# EAGLE design SHIELD-LOL-SMT (EAGLE 5.04)
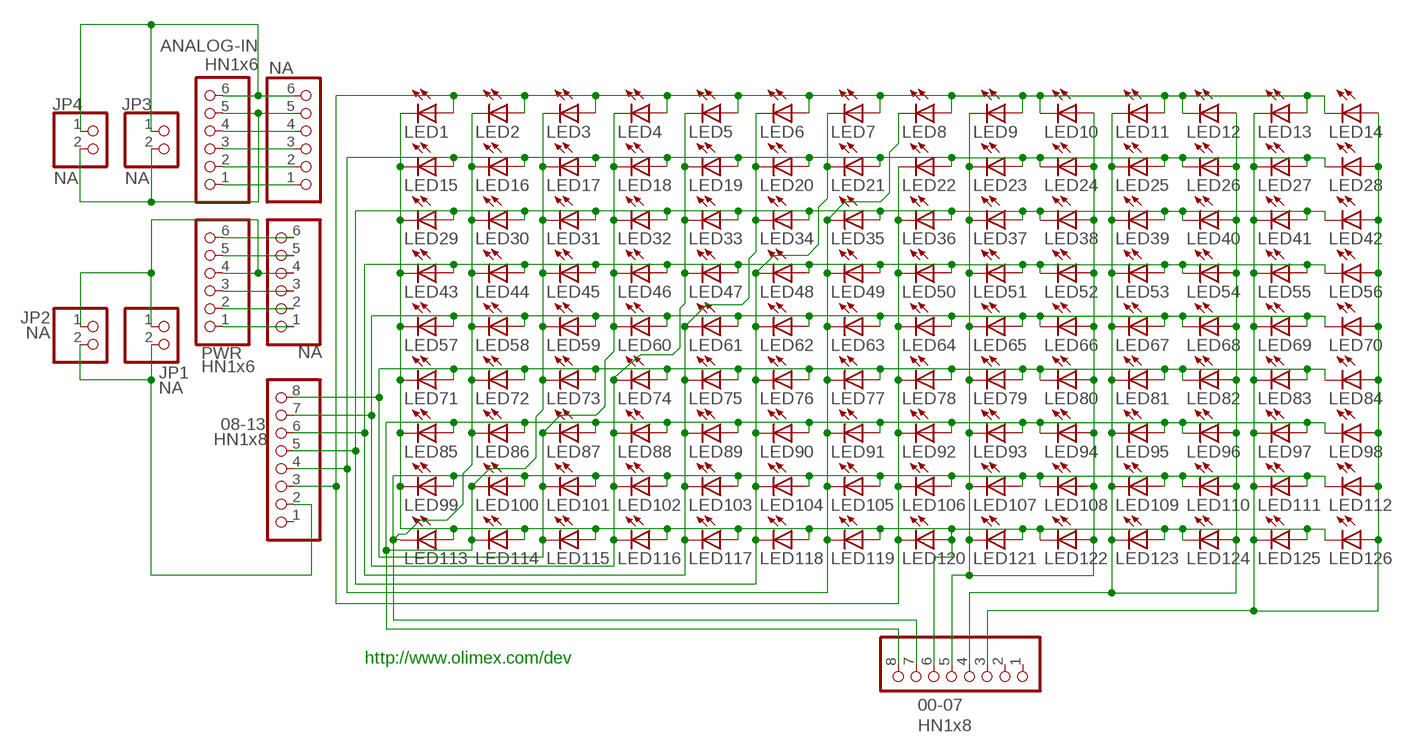
[diagram p0: schematic, sheet 1]

## Parts
00-07  HN1x8  PINHD-1X8CLEANBIG  [1X08-CLEANBIG]
08-13  HN1x8  PINHD-1X8CLEANBIG  [1X08-CLEANBIG]
AN-IN  NA  PINHD-1X6CB  [1X06-CLEANBIG]
ANALOG-IN  HN1x6  PINHD-1X6CB  [1X06-CLEANBIG]
JP1  NA  PINHD-1X2  [1X02]
JP2  NA  PINHD-1X2  [1X02]
JP3  NA  PINHD-1X2  [1X02]
JP4  NA  PINHD-1X2  [1X02]
LED1  LEDKA-3528ASYC  [KA-3528ASYC]
LED2  LEDKA-3528ASYC  [KA-3528ASYC]
LED3  LEDKA-3528ASYC  [KA-3528ASYC]
LED4  LEDKA-3528ASYC  [KA-3528ASYC]
LED5  LEDKA-3528ASYC  [KA-3528ASYC]
LED6  LEDKA-3528ASYC  [KA-3528ASYC]
LED7  LEDKA-3528ASYC  [KA-3528ASYC]
LED8  LEDKA-3528ASYC  [KA-3528ASYC]
LED9  LEDKA-3528ASYC  [KA-3528ASYC]
LED10  LEDKA-3528ASYC  [KA-3528ASYC]
LED11  LEDKA-3528ASYC  [KA-3528ASYC]
LED12  LEDKA-3528ASYC  [KA-3528ASYC]
LED13  LEDKA-3528ASYC  [KA-3528ASYC]
LED14  LEDKA-3528ASYC  [KA-3528ASYC]
LED15  LEDKA-3528ASYC  [KA-3528ASYC]
LED16  LEDKA-3528ASYC  [KA-3528ASYC]
LED17  LEDKA-3528ASYC  [KA-3528ASYC]
LED18  LEDKA-3528ASYC  [KA-3528ASYC]
LED19  LEDKA-3528ASYC  [KA-3528ASYC]
LED20  LEDKA-3528ASYC  [KA-3528ASYC]
LED21  LEDKA-3528ASYC  [KA-3528ASYC]
LED22  LEDKA-3528ASYC  [KA-3528ASYC]
LED23  LEDKA-3528ASYC  [KA-3528ASYC]
LED24  LEDKA-3528ASYC  [KA-3528ASYC]
LED25  LEDKA-3528ASYC  [KA-3528ASYC]
LED26  LEDKA-3528ASYC  [KA-3528ASYC]
LED27  LEDKA-3528ASYC  [KA-3528ASYC]
LED28  LEDKA-3528ASYC  [KA-3528ASYC]
LED29  LEDKA-3528ASYC  [KA-3528ASYC]
LED30  LEDKA-3528ASYC  [KA-3528ASYC]
LED31  LEDKA-3528ASYC  [KA-3528ASYC]
LED32  LEDKA-3528ASYC  [KA-3528ASYC]
LED33  LEDKA-3528ASYC  [KA-3528ASYC]
LED34  LEDKA-3528ASYC  [KA-3528ASYC]
LED35  LEDKA-3528ASYC  [KA-3528ASYC]
LED36  LEDKA-3528ASYC  [KA-3528ASYC]
LED37  LEDKA-3528ASYC  [KA-3528ASYC]
LED38  LEDKA-3528ASYC  [KA-3528ASYC]
LED39  LEDKA-3528ASYC  [KA-3528ASYC]
LED40  LEDKA-3528ASYC  [KA-3528ASYC]
LED41  LEDKA-3528ASYC  [KA-3528ASYC]
LED42  LEDKA-3528ASYC  [KA-3528ASYC]
LED43  LEDKA-3528ASYC  [KA-3528ASYC]
LED44  LEDKA-3528ASYC  [KA-3528ASYC]
LED45  LEDKA-3528ASYC  [KA-3528ASYC]
LED46  LEDKA-3528ASYC  [KA-3528ASYC]
LED47  LEDKA-3528ASYC  [KA-3528ASYC]
LED48  LEDKA-3528ASYC  [KA-3528ASYC]
LED49  LEDKA-3528ASYC  [KA-3528ASYC]
LED50  LEDKA-3528ASYC  [KA-3528ASYC]
LED51  LEDKA-3528ASYC  [KA-3528ASYC]
LED52  LEDKA-3528ASYC  [KA-3528ASYC]
LED53  LEDKA-3528ASYC  [KA-3528ASYC]
LED54  LEDKA-3528ASYC  [KA-3528ASYC]
LED55  LEDKA-3528ASYC  [KA-3528ASYC]
LED56  LEDKA-3528ASYC  [KA-3528ASYC]
LED57  LEDKA-3528ASYC  [KA-3528ASYC]
LED58  LEDKA-3528ASYC  [KA-3528ASYC]
LED59  LEDKA-3528ASYC  [KA-3528ASYC]
LED60  LEDKA-3528ASYC  [KA-3528ASYC]
LED61  LEDKA-3528ASYC  [KA-3528ASYC]
LED62  LEDKA-3528ASYC  [KA-3528ASYC]
LED63  LEDKA-3528ASYC  [KA-3528ASYC]
LED64  LEDKA-3528ASYC  [KA-3528ASYC]
LED65  LEDKA-3528ASYC  [KA-3528ASYC]
LED66  LEDKA-3528ASYC  [KA-3528ASYC]
LED67  LEDKA-3528ASYC  [KA-3528ASYC]
LED68  LEDKA-3528ASYC  [KA-3528ASYC]
LED69  LEDKA-3528ASYC  [KA-3528ASYC]
LED70  LEDKA-3528ASYC  [KA-3528ASYC]
LED71  LEDKA-3528ASYC  [KA-3528ASYC]
LED72  LEDKA-3528ASYC  [KA-3528ASYC]
LED73  LEDKA-3528ASYC  [KA-3528ASYC]
LED74  LEDKA-3528ASYC  [KA-3528ASYC]
LED75  LEDKA-3528ASYC  [KA-3528ASYC]
LED76  LEDKA-3528ASYC  [KA-3528ASYC]
LED77  LEDKA-3528ASYC  [KA-3528ASYC]
LED78  LEDKA-3528ASYC  [KA-3528ASYC]
LED79  LEDKA-3528ASYC  [KA-3528ASYC]
LED80  LEDKA-3528ASYC  [KA-3528ASYC]
LED81  LEDKA-3528ASYC  [KA-3528ASYC]
LED82  LEDKA-3528ASYC  [KA-3528ASYC]
LED83  LEDKA-3528ASYC  [KA-3528ASYC]
LED84  LEDKA-3528ASYC  [KA-3528ASYC]
LED85  LEDKA-3528ASYC  [KA-3528ASYC]
LED86  LEDKA-3528ASYC  [KA-3528ASYC]
LED87  LEDKA-3528ASYC  [KA-3528ASYC]
LED88  LEDKA-3528ASYC  [KA-3528ASYC]
LED89  LEDKA-3528ASYC  [KA-3528ASYC]
LED90  LEDKA-3528ASYC  [KA-3528ASYC]
LED91  LEDKA-3528ASYC  [KA-3528ASYC]
LED92  LEDKA-3528ASYC  [KA-3528ASYC]
LED93  LEDKA-3528ASYC  [KA-3528ASYC]
LED94  LEDKA-3528ASYC  [KA-3528ASYC]
LED95  LEDKA-3528ASYC  [KA-3528ASYC]
LED96  LEDKA-3528ASYC  [KA-3528ASYC]
LED97  LEDKA-3528ASYC  [KA-3528ASYC]
LED98  LEDKA-3528ASYC  [KA-3528ASYC]
LED99  LEDKA-3528ASYC  [KA-3528ASYC]
LED100  LEDKA-3528ASYC  [KA-3528ASYC]
LED101  LEDKA-3528ASYC  [KA-3528ASYC]
LED102  LEDKA-3528ASYC  [KA-3528ASYC]
LED103  LEDKA-3528ASYC  [KA-3528ASYC]
LED104  LEDKA-3528ASYC  [KA-3528ASYC]
LED105  LEDKA-3528ASYC  [KA-3528ASYC]
LED106  LEDKA-3528ASYC  [KA-3528ASYC]
LED107  LEDKA-3528ASYC  [KA-3528ASYC]
LED108  LEDKA-3528ASYC  [KA-3528ASYC]
LED109  LEDKA-3528ASYC  [KA-3528ASYC]
LED110  LEDKA-3528ASYC  [KA-3528ASYC]
LED111  LEDKA-3528ASYC  [KA-3528ASYC]
LED112  LEDKA-3528ASYC  [KA-3528ASYC]
LED113  LEDKA-3528ASYC  [KA-3528ASYC]
LED114  LEDKA-3528ASYC  [KA-3528ASYC]
LED115  LEDKA-3528ASYC  [KA-3528ASYC]
LED116  LEDKA-3528ASYC  [KA-3528ASYC]
LED117  LEDKA-3528ASYC  [KA-3528ASYC]
LED118  LEDKA-3528ASYC  [KA-3528ASYC]
LED119  LEDKA-3528ASYC  [KA-3528ASYC]
LED120  LEDKA-3528ASYC  [KA-3528ASYC]
LED121  LEDKA-3528ASYC  [KA-3528ASYC]
LED122  LEDKA-3528ASYC  [KA-3528ASYC]
LED123  LEDKA-3528ASYC  [KA-3528ASYC]
LED124  LEDKA-3528ASYC  [KA-3528ASYC]
LED125  LEDKA-3528ASYC  [KA-3528ASYC]
LED126  LEDKA-3528ASYC  [KA-3528ASYC]
POWER  NA  PINHD-1X6CB  [1X06-CLEANBIG]
PWR  HN1x6  PINHD-1X6CB  [1X06-CLEANBIG]

## Nets
N$1: 08-13.2 JP1.2 JP2.2
N$2: AN-IN.5 ANALOG-IN.5 JP3.2 JP4.2
N$5: 00-07.5 LED9.C LED10.A LED23.C LED24.A LED37.C LED38.A LED51.C LED52.A LED65.C LED66.A LED79.C LED80.A LED93.C LED94.A LED107.C LED108.A LED121.C LED122.A
N$11: AN-IN.6 ANALOG-IN.6 JP3.1 JP4.1
N$12: JP1.1 JP2.1 POWER.4 PWR.4
N$39: AN-IN.4 ANALOG-IN.4
N$40: AN-IN.3 ANALOG-IN.3
N$41: AN-IN.2 ANALOG-IN.2
N$42: AN-IN.1 ANALOG-IN.1
N$43: POWER.6 PWR.6
N$44: POWER.5 PWR.5
N$46: POWER.3 PWR.3
N$47: POWER.2 PWR.2
N$48: POWER.1 PWR.1
PIN2: 00-07.3 LED13.C LED14.A LED27.C LED28.A LED41.C LED42.A LED55.C LED56.A LED69.C LED70.A LED83.C LED84.A LED97.C LED98.A LED111.C LED112.A LED125.C LED126.A
PIN3: 00-07.4 LED11.C LED12.A LED25.C LED26.A LED39.C LED40.A LED53.C LED54.A LED67.C LED68.A LED81.C LED82.A LED95.C LED96.A LED109.C LED110.A LED123.C LED124.A
PIN5: 00-07.6 LED1.C LED15.C LED29.C LED43.C LED57.C LED71.C LED85.C LED99.C LED113.A LED114.A LED115.A LED116.A LED117.A LED118.A LED119.A LED120.A LED121.A LED122.C LED123.A LED124.C LED125.A LED126.C
PIN6: 00-07.7 LED2.C LED16.C LED30.C LED44.C LED58.C LED72.C LED86.C LED99.A LED100.A LED101.A LED102.A LED103.A LED104.A LED105.A LED106.A LED107.A LED108.C LED109.A LED110.C LED111.A LED112.C LED113.C
PIN7: 00-07.8 LED3.C LED17.C LED31.C LED45.C LED59.C LED73.C LED85.A LED86.A LED87.A LED88.A LED89.A LED90.A LED91.A LED92.A LED93.A LED94.C LED95.A LED96.C LED97.A LED98.C LED100.C LED114.C
PIN8: 08-13.8 LED4.C LED18.C LED32.C LED46.C LED60.C LED71.A LED72.A LED73.A LED74.A LED75.A LED76.A LED77.A LED78.A LED79.A LED80.C LED81.A LED82.C LED83.A LED84.C LED87.C LED101.C LED115.C
PIN9: 08-13.7 LED5.C LED19.C LED33.C LED47.C LED57.A LED58.A LED59.A LED60.A LED61.A LED62.A LED63.A LED64.A LED65.A LED66.C LED67.A LED68.C LED69.A LED70.C LED74.C LED88.C LED102.C LED116.C
PIN10: 08-13.6 LED6.C LED20.C LED34.C LED43.A LED44.A LED45.A LED46.A LED47.A LED48.A LED49.A LED50.A LED51.A LED52.C LED53.A LED54.C LED55.A LED56.C LED61.C LED75.C LED89.C LED103.C LED117.C
PIN11: 08-13.5 LED7.C LED21.C LED29.A LED30.A LED31.A LED32.A LED33.A LED34.A LED35.A LED36.A LED37.A LED38.C LED39.A LED40.C LED41.A LED42.C LED48.C LED62.C LED76.C LED90.C LED104.C LED118.C
PIN12: 08-13.4 LED8.C LED15.A LED16.A LED17.A LED18.A LED19.A LED20.A LED21.A LED22.A LED23.A LED24.C LED25.A LED26.C LED27.A LED28.C LED35.C LED49.C LED63.C LED77.C LED91.C LED105.C LED119.C
PIN13: 08-13.3 LED1.A LED2.A LED3.A LED4.A LED5.A LED6.A LED7.A LED8.A LED9.A LED10.C LED11.A LED12.C LED13.A LED14.C LED22.C LED36.C LED50.C LED64.C LED78.C LED92.C LED106.C LED120.C
Unconnected: 00-07.1 00-07.2 08-13.1

## Notes on the sheet
- http://www.olimex.com/dev

## Library data of the parts
00-07 08-13 = carduino:PINHD-1X8: PIN HEADER
AN-IN ANALOG-IN POWER PWR = carduino:PINHD-1X6: PIN HEADER
JP1 JP2 JP4 = pinhead:PINHD-1X2: PIN HEADER
JP3 = custom-jpr:PINHD-1X2: PIN HEADER
LED1-LED126 = led:LED: LED OSRAM: - CHIPLED LG R971, LG N971, LY N971, LG Q971, LY Q971, LO R971, LY R971 LH N974, LH R974 LS Q976, LO Q976, LY Q976 LO Q996 - Hyper CHIPLED LW Q18S LB Q993, LB Q99A, LB R99A - SideLED LS A670, LO A670, LY A670, LG A670, LP A670 LB A673, LV A673, LT A673, LW A673 LH A674 LY A675 LS A676, LA A676, LO A676, LY A676, LW A676 LS A679, LY A679, LG A679 - Hyper Micro SIDELED® LS Y876, LA Y876, LO Y876, LY Y876 LT Y87S - SmartLED LW L88C, LW L88S LB L89C, LB L89S, LG L890 LS L89K, LO L89K, LY L89K LS L896, LA L896, LO L896, LY L896 - TOPLED LS T670, LO T670, LY T670, LG T670, LP T670 LSG T670, LSP T670, LSY T670, LOP T670, LYG T670 LG T671, LOG T671, LSG T671 LB T673, LV T673, LT T673, LW T673 LH T674 LS T676, LA T676, LO T676, LY T676, LB T676, LH T676, LSB T676, LW T676 LB T67C, LV T67C, LT T67C, LS T67K, LO T67K, LY T67K, LW E67C LS E67B, LA E67B, LO E67B, LY E67B, LB E67C, LV E67C, LT E67C LW T67C LS T679, LY T679, LG T679 LS T770, LO T770, LY T770, LG T770, LP T770 LB T773, LV T773, LT T773, LW T773 LH T774 LS E675, LA E675, LY E675, LS T675 LS T776, LA T776, LO T776, LY T776, LB T776 LHGB T686 LT T68C, LB T68C - Hyper Mini TOPLED® LB M676 - Mini TOPLED Santana® LG M470 LS M47K, LO M47K, LY M47K Source: http://www.osram.convergy.de LUXEON: - LUMILED® LXK2-PW12-R00, LXK2-PW12-S00, LXK2-PW14-U00, LXK2-PW14-V00 LXK2-PM12-R00, LXK2-PM12-S00, LXK2-PM14-U00 LXK2-PE12-Q00, LXK2-PE12-R00, LXK2-PE12-S00, LXK2-PE14-T00, LXK2-PE14-U00 LXK2-PB12-K00, LXK2-PB12-L00, LXK2-PB12-M00, LXK2-PB14-N00, LXK2-PB14-P00, LXK2-PB14-Q00 LXK2-PR12-L00, LXK2-PR12-M00, LXK2-PR14-Q00, LXK2-PR14-R00 LXK2-PD12-Q00, LXK2-PD12-R00, LXK2-PD12-S00 LXK2-PH12-R00, LXK2-PH12-S00 LXK2-PL12-P00, LXK2-PL12-Q00, LXK2-PL12-R00 Source: www.luxeon.com KINGBRIGHT: KA-3528ASYC Source: www.kingbright.com

## Board
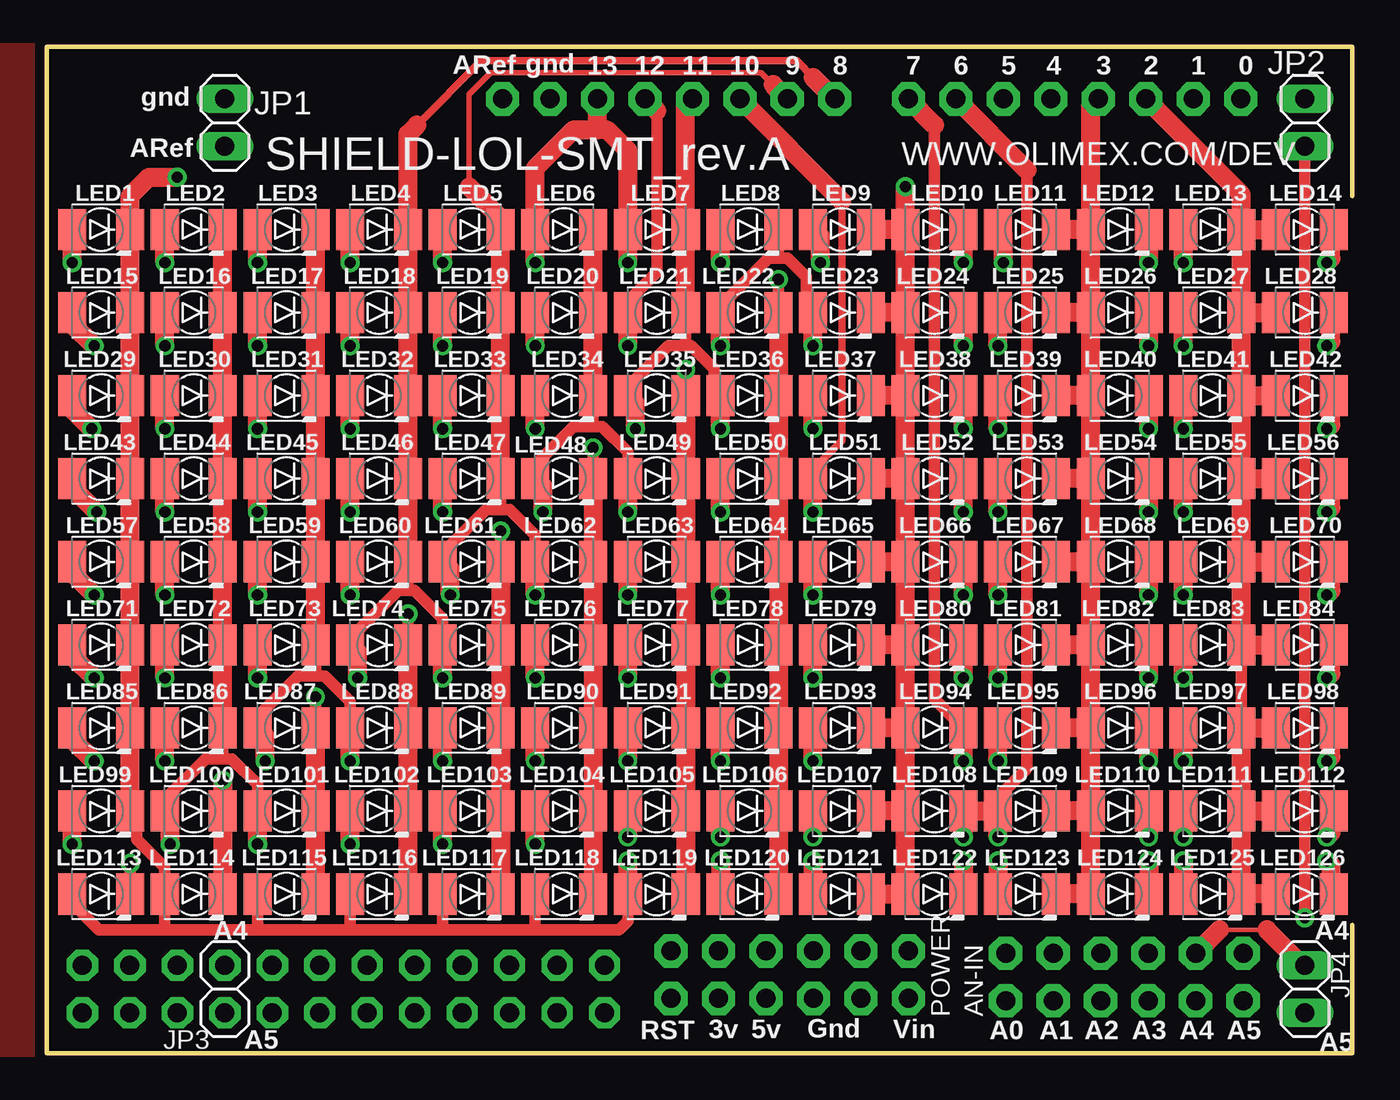
[diagram p1: board, top side]
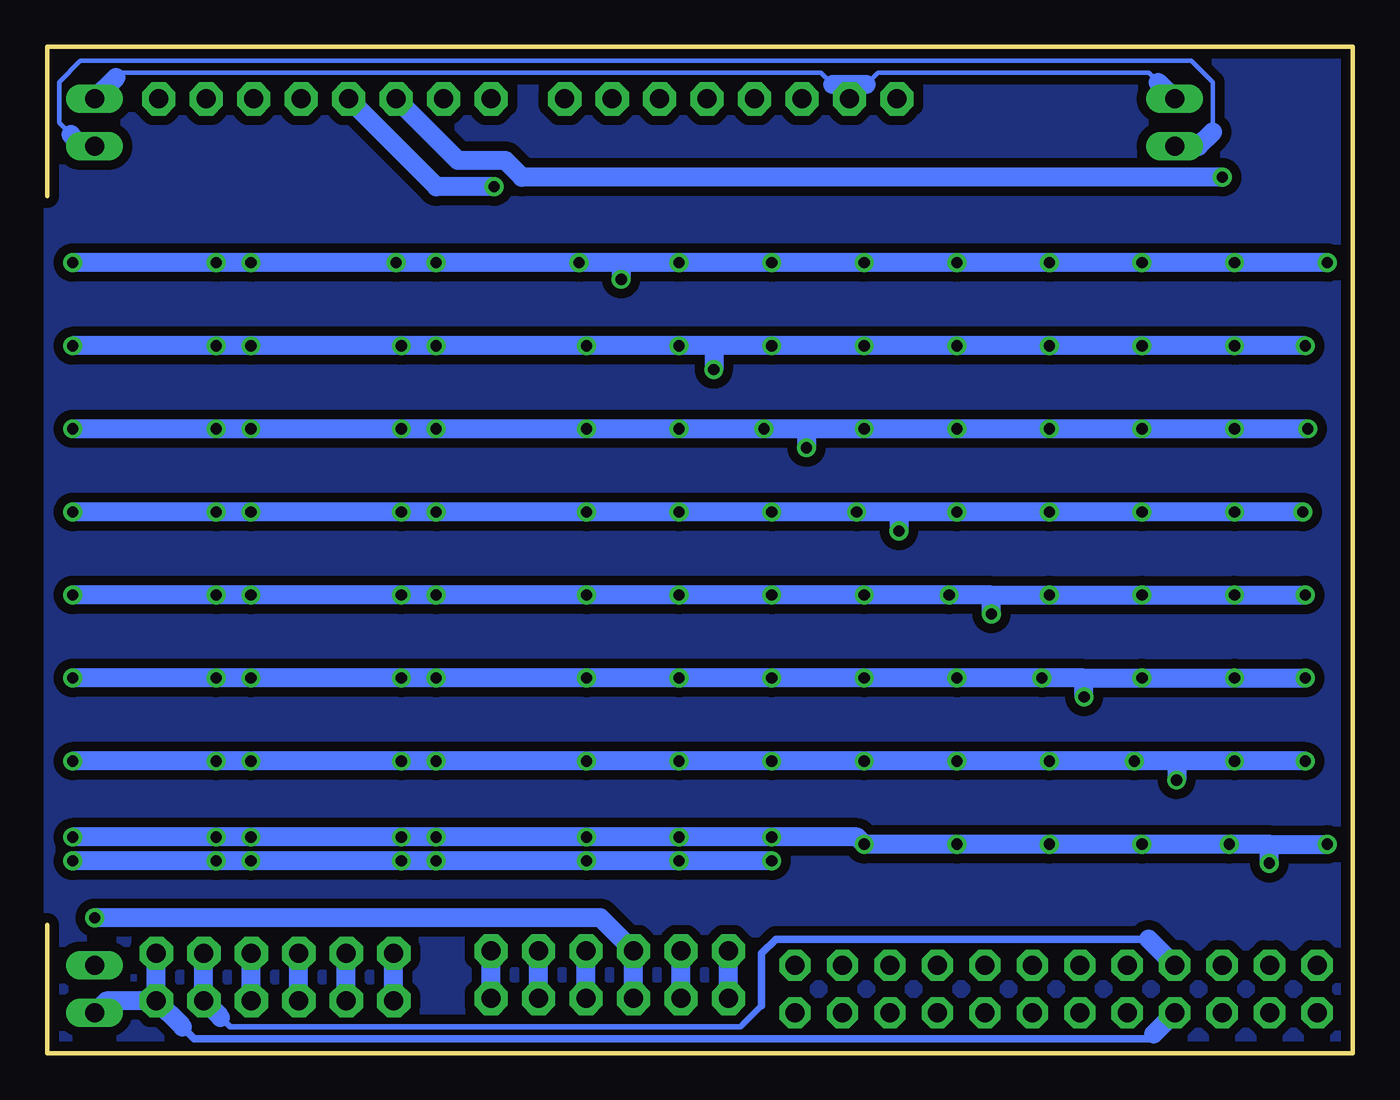
[diagram p2: board, bottom side, seen from below]

Size 69.85 x 53.85 mm. Coordinates in mm from the lower left corner, seen from the top.
Outline: 69.85,45.85 69.85,53.85 0,53.85 0,0 69.85,0 69.85,6.86
Copper layers (1+16): Top 0.035mm / dielectric 1.5mm / Bottom 0.035mm
Design rules "default *": minimum track width 10mil, minimum drill 19mil, track to track 10mil, track to pad 10mil, pad to pad 10mil, via to via 10mil, smd to smd 0mil, copper to edge 10mil, drill to drill 8mil, minimum pad ring 10mil, minimum via ring 8mil, stop-mask expansion 4mil, vias tented up to drill 32mil, thermal gap 10mil

### Footprints (pad centres in the part's own frame; a part is rotated, then mirrored left to right if it is on the bottom)
1X08-CLEANBIG = drill 1.016 pad 1.778 octagon: 1 -8.89,0; 2 -6.35,0; 3 -3.81,0; 4 -1.27,0; 5 1.27,0; 6 3.81,0; 7 6.35,0; 8 8.89,0
1X06-CLEANBIG = drill 1.016 pad 1.778 octagon: 1 -6.35,0; 2 -3.81,0; 3 -1.27,0; 4 1.27,0; 5 3.81,0; 6 6.35,0
1X02 = drill 1.016 long: 1 -1.27,0; 2 1.27,0
1X02' = drill 1.016 pad 1.676 octagon: 1 -1.27,0; 2 1.27,0
KA-3528ASYC = smd 1.5 x 2.2: A -1.55,0; C 1.55,0

### Placement (x,y rotation side)
00-07  54.99,51.05 180 top
08-13  33.27,51.05 0 top
AN-IN  57.66,5.33 0 top
ANALOG-IN  57.66,2.79 0 top
JP1  9.53,49.78 90 top
JP2  67.31,49.78 90 top
JP3  NA  [1X02']  9.53,3.43 90 top
JP4  67.31,3.43 90 top
LED1  2.92,44.07 0 top
LED2  7.87,44.07 0 top
LED3  12.83,44.07 0 top
LED4  17.78,44.07 0 top
LED5  22.73,44.07 0 top
LED6  27.69,44.07 0 top
LED7  32.64,44.07 0 top
LED8  37.59,44.07 0 top
LED9  42.55,44.07 0 top
LED10  47.5,44.07 0 top
LED11  52.45,44.07 0 top
LED12  57.4,44.07 0 top
LED13  62.36,44.07 0 top
LED14  67.31,44.07 0 top
LED15  2.92,39.62 0 top
LED16  7.87,39.62 0 top
LED17  12.83,39.62 0 top
LED18  17.78,39.62 0 top
LED19  22.73,39.62 0 top
LED20  27.69,39.62 0 top
LED21  32.64,39.62 0 top
LED22  37.59,39.62 0 top
LED23  42.55,39.62 0 top
LED24  47.5,39.62 0 top
LED25  52.45,39.62 0 top
LED26  57.4,39.62 0 top
LED27  62.36,39.62 0 top
LED28  67.31,39.62 0 top
LED29  2.92,35.18 0 top
LED30  7.87,35.18 0 top
LED31  12.83,35.18 0 top
LED32  17.78,35.18 0 top
LED33  22.73,35.18 0 top
LED34  27.69,35.18 0 top
LED35  32.64,35.18 0 top
LED36  37.59,35.18 0 top
LED37  42.55,35.18 0 top
LED38  47.5,35.18 0 top
LED39  52.45,35.18 0 top
LED40  57.4,35.18 0 top
LED41  62.36,35.18 0 top
LED42  67.31,35.18 0 top
LED43  2.92,30.73 0 top
LED44  7.87,30.73 0 top
LED45  12.83,30.73 0 top
LED46  17.78,30.73 0 top
LED47  22.73,30.73 0 top
LED48  27.69,30.73 0 top
LED49  32.64,30.73 0 top
LED50  37.59,30.73 0 top
LED51  42.55,30.73 0 top
LED52  47.5,30.73 0 top
LED53  52.45,30.73 0 top
LED54  57.4,30.73 0 top
LED55  62.36,30.73 0 top
LED56  67.31,30.73 0 top
LED57  2.92,26.29 0 top
LED58  7.87,26.29 0 top
LED59  12.83,26.29 0 top
LED60  17.78,26.29 0 top
LED61  22.73,26.29 0 top
LED62  27.69,26.29 0 top
LED63  32.64,26.29 0 top
LED64  37.59,26.29 0 top
LED65  42.55,26.29 0 top
LED66  47.5,26.29 0 top
LED67  52.45,26.29 0 top
LED68  57.4,26.29 0 top
LED69  62.36,26.29 0 top
LED70  67.31,26.29 0 top
LED71  2.92,21.84 0 top
LED72  7.87,21.84 0 top
LED73  12.83,21.84 0 top
LED74  17.78,21.84 0 top
LED75  22.73,21.84 0 top
LED76  27.69,21.84 0 top
LED77  32.64,21.84 0 top
LED78  37.59,21.84 0 top
LED79  42.55,21.84 0 top
LED80  47.5,21.84 0 top
LED81  52.45,21.84 0 top
LED82  57.4,21.84 0 top
LED83  62.36,21.84 0 top
LED84  67.31,21.84 0 top
LED85  2.92,17.4 0 top
LED86  7.87,17.4 0 top
LED87  12.83,17.4 0 top
LED88  17.78,17.4 0 top
LED89  22.73,17.4 0 top
LED90  27.69,17.4 0 top
LED91  32.64,17.4 0 top
LED92  37.59,17.4 0 top
LED93  42.55,17.4 0 top
LED94  47.5,17.4 0 top
LED95  52.45,17.4 0 top
LED96  57.4,17.4 0 top
LED97  62.36,17.4 0 top
LED98  67.31,17.4 0 top
LED99  2.92,12.95 0 top
LED100  7.87,12.95 0 top
LED101  12.83,12.95 0 top
LED102  17.78,12.95 0 top
LED103  22.73,12.95 0 top
LED104  27.69,12.95 0 top
LED105  32.64,12.95 0 top
LED106  37.59,12.95 0 top
LED107  42.55,12.95 0 top
LED108  47.5,12.95 0 top
LED109  52.45,12.95 0 top
LED110  57.4,12.95 0 top
LED111  62.36,12.95 0 top
LED112  67.31,12.95 0 top
LED113  2.92,8.51 0 top
LED114  7.87,8.51 0 top
LED115  12.83,8.51 0 top
LED116  17.78,8.51 0 top
LED117  22.73,8.51 0 top
LED118  27.69,8.51 0 top
LED119  32.64,8.51 0 top
LED120  37.59,8.51 0 top
LED121  42.55,8.51 0 top
LED122  47.5,8.51 0 top
LED123  52.45,8.51 0 top
LED124  57.4,8.51 0 top
LED125  62.36,8.51 0 top
LED126  67.31,8.51 0 top
POWER  39.75,5.46 180 top
PWR  39.75,2.92 180 top

### Tracks (layer width: path | path; a pad name or v marks a point on that pad's centre or on a via)
BOTTOMFILL
  pour Bottom (isolate 0.508): 0,53.85 69.85,53.85 69.85,0 0,0
N$1
  Bottom 0.254: 10.41,51.94 10.92,52.45 25.4,52.45 26.04,51.82 | 27.81,51.82 28.45,52.45 65.91,52.45 66.17,52.2
  Bottom 1.016: JP1.2 10.41,51.94 | 26.04,51.82 26.92,51.82 | 26.92,51.82 08-13.2 | 26.92,51.82 27.81,51.82 | 66.17,52.2 JP2.2
N$2
  Top 0.254: 62.74,6.6 65.28,6.6
  Top 1.016: AN-IN.5 62.74,6.6 | 65.28,6.6 67.18,4.7 JP4.2
  Bottom 0.305: 60.58,1.91 60.07,1.4 32.77,1.4 31.62,2.54
  Bottom 0.406: 10.92,6.1 30.86,6.1 31.62,5.33 31.62,2.54
  Bottom 1.016: AN-IN.5 ANALOG-IN.5 60.58,1.91 | JP3.2 10.92,6.1
N$3  (via drill 1.02 pad 1.68)
  other vias: 6.99,4.7
N$5  (via drill 0.6)
  Top 1.016: LED121.C LED122.A LED108.A | LED108.A LED107.C | LED94.A LED93.C | LED80.A LED79.C | LED66.A LED65.C | LED52.A LED51.C | LED38.A LED37.C | LED24.A LED23.C | LED10.A LED9.C | LED24.A LED10.A | LED38.A LED24.A | LED52.A LED38.A | LED94.A LED80.A | LED80.A LED66.A | LED66.A LED52.A | LED108.A LED94.A | LED10.A v45.95,46.35
  Bottom 1.016: v45.95,46.35 49.02,46.35 00-07.5
N$7  (via drill 1.02 pad 1.68)
  other vias: 12.06,4.7
N$8  (via drill 1.02 pad 1.68)
  other vias: 14.61,4.7
N$9  (via drill 1.02 pad 1.68)
  other vias: 17.14,4.7
N$10  (via drill 1.02 pad 1.68)
  other vias: 19.68,4.7
N$11
  Bottom 0.406: 10.67,1.02 10.92,0.76 61.98,0.76 62.61,1.4
  Bottom 1.016: ANALOG-IN.6 AN-IN.6 | ANALOG-IN.6 66.67,2.79 JP4.1 | JP3.1 10.67,1.02 | 62.61,1.4 ANALOG-IN.6
N$12  (via drill 0.6)
  Top 0.61: v67.31,7.24 JP2.1
  Bottom 0.254: 7.49,49.28 7.49,51.94 8.64,53.09 68.07,53.09 69.22,51.94 69.22,49.78 68.58,49.15
  Bottom 1.016: PWR.4 POWER.4 40.26,7.24 v67.31,7.24 | JP1.1 8.26,48.51 7.49,49.28 | 68.58,49.15 67.94,48.51 JP2.1
N$13  (via drill 1.02 pad 1.68)
  other vias: 6.99,2.16
N$15  (via drill 1.02 pad 1.68)
  other vias: 12.06,2.16
N$18  (via drill 1.02 pad 1.68)
  other vias: 14.61,2.16
N$27  (via drill 1.02 pad 1.68)
  other vias: 17.14,2.16
N$28  (via drill 1.02 pad 1.68)
  other vias: 19.68,2.16
N$29  (via drill 1.02 pad 1.68)
  other vias: 22.23,4.7
N$30  (via drill 1.02 pad 1.68)
  other vias: 22.23,2.16
N$31  (via drill 1.02 pad 1.68)
  other vias: 24.77,4.7
N$32  (via drill 1.02 pad 1.68)
  other vias: 24.77,2.16
N$33  (via drill 1.02 pad 1.68)
  other vias: 29.84,4.7
N$34  (via drill 1.02 pad 1.68)
  other vias: 27.3,2.16
N$35  (via drill 1.02 pad 1.68)
  other vias: 29.84,2.16
N$36  (via drill 1.02 pad 1.68)
  other vias: 27.3,4.7
N$37  (via drill 1.02 pad 1.68)
  other vias: 1.91,4.7
N$38  (via drill 1.02 pad 1.68)
  other vias: 1.91,2.16
N$39
  Bottom 1.016: ANALOG-IN.4 AN-IN.4
N$40
  Bottom 1.016: ANALOG-IN.3 AN-IN.3
N$41
  Bottom 1.016: ANALOG-IN.2 AN-IN.2
N$42
  Bottom 1.016: ANALOG-IN.1 AN-IN.1
N$43
  Bottom 1.016: PWR.6 POWER.6
N$44
  Bottom 1.016: PWR.5 POWER.5
N$45  (via drill 1.02 pad 1.68)
  other vias: 4.45,4.7
N$46
  Bottom 1.016: PWR.3 POWER.3
N$47
  Bottom 1.016: PWR.2 POWER.2
N$48
  Bottom 1.016: PWR.1 POWER.1
N$49  (via drill 1.02 pad 1.68)
  other vias: 4.45,2.16
PIN2
  Top 0.61: LED97.C LED83.C
  Top 1.016: LED111.C LED112.A | LED98.A LED97.C LED111.C | LED84.A LED83.C LED69.C | LED69.C LED70.A | LED55.C LED56.A | LED41.C LED42.A | LED27.C LED28.A | LED126.A LED125.C LED111.C | LED69.C LED55.C | LED55.C LED41.C | LED41.C LED27.C | LED13.C 63.91,45.95 00-07.3 | LED13.C LED14.A | LED27.C LED13.C
PIN3
  Top 1.016: LED12.A LED11.C | LED26.A LED25.C | LED40.A LED39.C | LED54.A LED53.C | LED68.A LED67.C | LED82.A LED81.C | LED96.A LED95.C | LED110.A LED109.C | LED123.C LED124.A LED110.A | LED110.A LED96.A | LED96.A LED82.A | LED82.A LED68.A | LED68.A LED54.A | LED54.A LED40.A | LED40.A LED26.A | LED26.A LED12.A | LED12.A 55.85,50.65 00-07.4
PIN5  (via drill 0.6)
  Top 0.61: LED99.C 4.83,12.6 4.83,11.43 6.32,9.93 LED114.A 6.32,6.6 | LED113.A 1.37,8.03 2.79,6.6 6.32,6.6 | 11.28,6.6 LED115.A | 16.23,6.6 LED116.A | 21.18,6.6 LED117.A | 26.14,6.6 LED118.A | 6.32,6.6 11.28,6.6 | 11.28,6.6 16.23,6.6 | 16.23,6.6 21.18,6.6 | 21.18,6.6 26.14,6.6 | LED119.A 31.09,7.09 30.61,6.6 26.14,6.6
  Top 1.016: LED99.C LED85.C LED71.C LED57.C LED43.C LED29.C LED15.C LED1.C 4.47,45.87 5.46,46.86 v6.99,46.86 | v68.48,10.29 68.71,10.06 68.71,8.66 LED126.C | v40.99,10.29 LED121.A | v49.05,10.29 LED122.C | v58.95,10.29 LED124.C | LED119.A v31.09,10.29 | v36.04,10.29 LED120.A | v50.9,10.29 LED123.A | v60.81,10.29 LED125.A
  Bottom 1.016: v68.48,10.29 v60.81,10.29 v58.95,10.29 v50.9,10.29 v49.05,10.29 v40.99,10.29 v36.04,10.29 v31.09,10.29 | v6.99,46.86 44.45,46.86 45.34,47.75 47.88,47.75 00-07.6
PIN6  (via drill 0.6)
  Top 0.61: 9.42,15.75 LED86.C | LED101.A 11.28,14.38 9.91,15.75 9.42,15.75 | 9.42,15.75 8.51,15.75 6.32,13.56 | LED113.C v4.47,10.16 | 52.45,47.24 52.45,15.24 50.9,13.69 LED109.A
  Top 1.016: LED86.C LED72.C LED58.C LED44.C LED30.C LED16.C LED2.C | 6.32,13.56 LED100.A | v68.48,11.56 68.71,11.79 68.71,12.8 LED112.C | v1.37,11.18 LED99.A | v6.6,11.18 6.6,12.83 | v50.9,11.56 LED109.A LED108.C v49.05,11.56 | v40.99,11.56 LED107.A | v36.04,11.56 LED106.A | v31.09,11.56 LED105.A | v26.14,11.18 LED104.A | v21.18,11.18 LED103.A | v16.23,11.18 LED102.A | v11.28,11.18 LED101.A | v58.95,11.56 LED110.C | v60.81,11.56 LED111.A | 52.45,47.24 00-07.7
  Bottom 1.016: 4.47,11.18 v1.37,11.18 | v4.47,10.16 4.47,11.18 | 4.47,11.18 v6.6,11.18 v11.28,11.18 v16.23,11.18 v21.18,11.18 v26.14,11.18 26.52,11.56 v31.09,11.56 v36.04,11.56 v40.99,11.56 v49.05,11.56 v50.9,11.56 v58.95,11.56 v60.81,11.56 v68.48,11.56
PIN7  (via drill 0.6)
  Top 0.61: LED88.A 16.23,18.82 14.86,20.19 14.38,20.19 | 14.38,20.19 LED73.C | LED87.A 11.28,18.01 13.46,20.19 14.38,20.19 | LED94.C 47.5,18.95 47.5,49.66
  Top 1.016: LED3.C LED17.C LED31.C LED45.C LED59.C LED73.C | v68.48,15.62 68.71,15.85 68.71,17.25 LED98.C | LED85.A 1.37,16.79 v2.54,15.62 | v11.68,15.62 11.68,16.99 LED87.A | v6.32,15.62 LED86.A | v9.42,14.61 LED100.C LED114.C | v50.9,15.62 LED95.A | v60.81,15.62 LED97.A | v21.18,15.62 LED89.A | v26.14,15.62 LED90.A | v31.09,15.62 LED91.A | v36.04,15.62 LED92.A | v40.99,15.62 LED93.A | v16.23,15.62 LED88.A | v49.05,15.62 LED94.C | v58.95,15.62 LED96.C | 47.5,49.66 00-07.8
  Bottom 1.016: 9.42,15.62 v11.68,15.62 v16.23,15.62 v21.18,15.62 v26.14,15.62 v31.09,15.62 v36.04,15.62 v40.99,15.62 v49.05,15.62 v50.9,15.62 v58.95,15.62 v60.81,15.62 v68.48,15.62 | v2.54,15.62 v6.32,15.62 9.42,15.62 | 9.42,15.62 v9.42,14.61
PIN8  (via drill 0.6)
  Top 0.406: LED74.A 16.23,22.2 | 41.02,52.2 40.13,53.09 23.24,53.09 19.81,49.66
  Top 0.61: 19.33,24.77 LED60.C | LED75.A 21.18,23.27 19.68,24.77 19.33,24.77 | 16.23,22.2 18.8,24.77 19.33,24.77 | LED87.C v14.38,19.05
  Top 1.016: LED60.C LED46.C LED32.C LED18.C LED4.C 19.33,49.17 19.81,49.66 | 41.02,52.2 08-13.8 | LED115.C LED101.C LED87.C | v2.54,20.07 1.37,21.24 LED71.A | v68.48,20.07 68.71,20.29 68.71,21.69 LED84.C | v6.32,20.07 LED72.A | v16.64,20.07 16.64,21.44 LED74.A | v11.28,20.07 LED73.A | v26.14,20.07 LED76.A | v31.09,20.07 LED77.A | v36.04,20.07 LED78.A | v40.99,20.07 LED79.A | v49.05,20.07 LED80.C | v50.9,20.07 LED81.A | v58.95,20.07 LED82.C | v60.81,20.07 LED83.A | v21.18,20.07 LED75.A
  Bottom 1.016: v2.54,20.07 v6.32,20.07 v11.28,20.07 14.38,20.07 | 14.38,20.07 v16.64,20.07 v21.18,20.07 v26.14,20.07 v31.09,20.07 v36.04,20.07 v40.99,20.07 v49.05,20.07 v50.9,20.07 v58.95,20.07 v60.81,20.07 v68.48,20.07 | v14.38,19.05 14.38,20.07
PIN9  (via drill 0.6)
  Top 0.305: 38.86,51.82 38.23,52.45 23.75,52.45 22.61,51.31 22.61,46.35
  Top 0.61: LED62.A 26.14,27.71 24.77,29.08 24.28,29.08 | 24.28,29.08 LED47.C | LED61.A 21.18,26.77 23.5,29.08 24.28,29.08 | LED74.C v19.33,23.5
  Top 1.016: LED47.C LED33.C LED19.C LED5.C 24.28,44.68 22.61,46.35 | LED74.C LED88.C LED102.C LED116.C | 38.86,51.82 08-13.7 | v68.48,24.51 68.71,24.74 68.71,26.14 LED70.C | v2.54,24.51 1.37,25.68 LED57.A | v21.59,24.51 21.59,25.88 LED61.A | v16.23,24.51 LED60.A | v11.28,24.51 LED59.A | v6.32,24.51 LED58.A | v36.04,24.51 LED64.A | v40.99,24.51 LED65.A | v49.05,24.51 LED66.C | v60.81,24.51 LED69.A | v26.14,24.51 LED62.A | v50.9,24.51 LED67.A | v58.95,24.51 LED68.C | v31.09,24.51 LED63.A
  Bottom 1.016: 19.33,24.51 v21.59,24.51 v26.14,24.51 v31.09,24.51 v36.04,24.51 v40.99,24.51 v49.05,24.51 v50.9,24.51 v58.95,24.51 v60.81,24.51 v68.48,24.51 | v2.54,24.51 v6.32,24.51 v11.28,24.51 v16.23,24.51 19.33,24.51 | v19.33,23.5 19.33,24.51
PIN10  (via drill 0.6)
  Top 0.406: LED34.C LED20.C | LED51.A 40.99,31.22 42.55,32.77 42.55,45.59
  Top 0.61: 29.24,33.53 29.72,33.53 31.09,32.16 LED49.A | 29.24,33.53 LED34.C | LED48.A 26.14,31.47 28.19,33.53 29.24,33.53 | v24.28,27.94 LED61.C
  Top 1.016: LED61.C LED75.C LED89.C LED103.C LED117.C | LED6.C LED20.C LED34.C | v2.67,28.96 1.37,30.25 LED43.A | v68.48,28.96 68.71,29.18 68.71,30.58 LED56.C | v26.54,28.96 26.54,30.33 LED48.A | v21.18,28.96 LED47.A | v16.23,28.96 LED46.A | v11.28,28.96 LED45.A | v6.32,28.96 LED44.A | v58.95,28.96 LED54.C | v49.05,28.96 LED52.C | v36.04,28.96 LED50.A | v31.09,28.96 LED49.A | v40.99,28.96 LED51.A | v50.9,28.96 LED53.A | v60.81,28.96 LED55.A | 42.55,45.59 08-13.6
  Bottom 1.016: v2.67,28.96 v6.32,28.96 v11.28,28.96 v16.23,28.96 v21.18,28.96 24.28,28.96 | 24.28,28.96 v26.54,28.96 v31.09,28.96 v36.04,28.96 v40.99,28.96 v49.05,28.96 v50.9,28.96 v58.95,28.96 v60.81,28.96 v68.48,28.96 | 24.28,28.96 v24.28,27.94
PIN11  (via drill 0.6)
  Top 0.61: 34.19,37.85 LED21.C | LED36.A 35.69,35.53 35.69,36.63 34.47,37.85 34.19,37.85 | LED35.A 31.09,35.66 33.27,37.85 34.19,37.85 | v29.24,32.38 LED48.C
  Top 1.016: 08-13.5 34.19,50.7 LED7.C LED21.C | LED48.C LED62.C LED76.C LED90.C LED104.C LED118.C | v68.48,33.4 68.71,33.63 68.71,35.03 LED42.C | LED29.A 1.37,34.44 v2.41,33.4 | v31.5,33.4 31.5,34.77 LED35.A | v36.04,33.4 LED36.A | v40.99,33.4 LED37.A | v49.05,33.4 LED38.C | v50.9,33.4 LED39.A | v58.95,33.4 LED40.C | v60.81,33.4 LED41.A | v6.32,33.4 LED30.A | v11.28,33.4 LED31.A | v16.23,33.4 LED32.A | v26.14,33.4 LED34.A | v21.18,33.4 LED33.A
  Bottom 1.016: v2.41,33.4 v6.32,33.4 v11.28,33.4 v16.23,33.4 v21.18,33.4 v26.14,33.4 29.24,33.4 | 29.24,33.4 v31.5,33.4 v36.04,33.4 v40.99,33.4 v49.05,33.4 v50.9,33.4 v58.95,33.4 v60.81,33.4 v68.48,33.4 | 29.24,33.4 v29.24,32.38
PIN12  (via drill 0.6)
  Top 0.406: LED22.A 36.04,39.98
  Top 0.61: v34.19,36.58 LED35.C | LED21.A 31.09,40.23 32.64,41.78 32.64,50.42 | 36.04,39.98 38.61,42.54 39.14,42.54 | 39.14,42.54 LED8.C | LED23.A 40.64,39.98 40.64,41.53 39.62,42.54 39.14,42.54
  Top 1.016: LED35.C LED49.C LED63.C LED77.C LED91.C LED105.C LED119.C | v31.09,37.85 LED21.A | LED15.A 1.37,39.02 v2.54,37.85 | v6.32,37.85 LED16.A | v11.28,37.85 LED17.A | v16.23,37.85 LED18.A | v21.18,37.85 LED19.A | v26.14,37.85 LED20.A | v36.04,37.85 LED22.A | 32.64,50.42 08-13.4 | v68.48,37.85 68.71,38.07 68.71,39.47 LED28.C | v40.99,37.85 LED23.A | v49.05,37.85 LED24.C | v50.9,37.85 LED25.A | v58.95,37.85 LED26.C | v60.81,37.85 LED27.A
  Bottom 1.016: v2.54,37.85 v6.32,37.85 v11.28,37.85 v16.23,37.85 v21.18,37.85 v26.14,37.85 v31.09,37.85 34.19,37.85 | 34.19,37.85 v34.19,36.58 | 34.19,37.85 v36.04,37.85 v40.99,37.85 v49.05,37.85 v50.9,37.85 v58.95,37.85 v60.81,37.85 v68.48,37.85
PIN13  (via drill 0.6)
  Top 0.61: v39.14,41.4 LED22.C
  Top 1.016: LED22.C LED36.C LED50.C LED64.C LED78.C LED92.C LED106.C LED120.C | 29.46,49.4 29.97,49.4 31.09,48.29 LED7.A v31.09,42.29 | 29.46,49.4 28.19,49.4 26.14,47.34 LED6.A v26.14,42.29 | 29.46,49.4 08-13.3 | v1.37,42.29 LED1.A | v68.48,42.29 68.71,42.52 68.71,43.92 LED14.C | v41.4,42.29 41.4,43.66 LED9.A | v6.32,42.29 LED2.A | v11.28,42.29 LED3.A | v16.23,42.29 LED4.A | v49.05,42.29 LED10.C | v51.18,42.29 51.18,43.79 LED11.A | v58.95,42.29 LED12.C | v60.81,42.29 LED13.A | v36.04,42.29 LED8.A | v21.18,42.29 LED5.A
  Bottom 1.016: v1.37,42.29 v6.32,42.29 v11.28,42.29 v16.23,42.29 v21.18,42.29 v26.14,42.29 v31.09,42.29 v36.04,42.29 39.14,42.29 | 39.14,42.29 v41.4,42.29 v49.05,42.29 v51.18,42.29 v58.95,42.29 v60.81,42.29 v68.48,42.29 | 39.14,42.29 v39.14,41.4
TOPFILL
  pour Top (isolate 0.508): 0,53.85 -6.35,53.85 -6.35,0 0,0

### Text on the board
tPlace: 13 | 12 | 11 | 10 | 9 | 8 | 7 | 6 | 5 | 4 | 3 | 2 | 1 | 0 | ARef | gnd | gnd | ARef | SHIELD-LOL-SMT_rev.A | WWW.OLIMEX.COM/DEV | A4 | A4 | 3v | 5v | Gnd | Vin | RST | A5 | A0 | A1 | A2 | A3 | A4 | A5 | A5
tValues: - | +
bDocu: v1.5